# Altium schematic sheet schematic.SchDoc: MMA Controller Shield
size A4; DrawnBy: Sandro Petrovski; SheetNumber: 1; SheetTotal: 1; SheetSize: A4
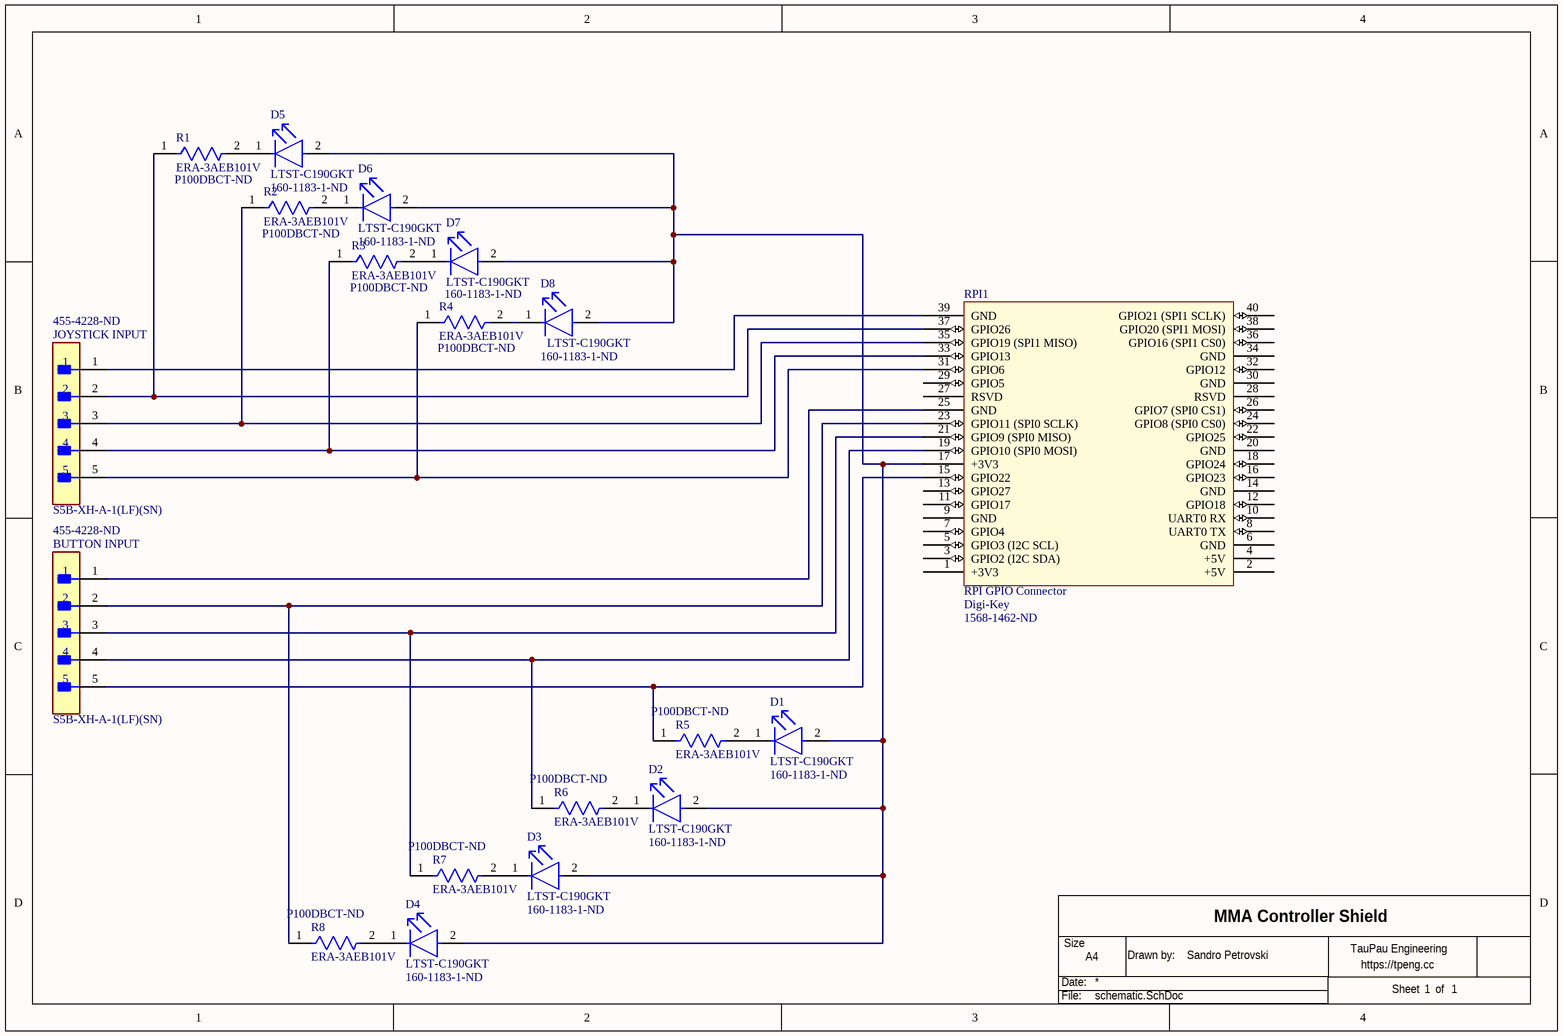
[diagram p0: schematic.SchDoc]

## Parts
*  TPE Title Block  (value not drawn)
BUTTON_INPUT  S5B-XH-A-1(LF)(SN)  Supplier Part Number 1: 455-4228-ND  [FP-S5B-XH-A-1_LF_SN-MFG]
D1  LTST-C190GKT  Supplier Part Number 1: 160-1183-1-ND  [FP-LTST-C190GKT-MFG]
D2  LTST-C190GKT  Supplier Part Number 1: 160-1183-1-ND  [FP-LTST-C190GKT-MFG]
D3  LTST-C190GKT  Supplier Part Number 1: 160-1183-1-ND  [FP-LTST-C190GKT-MFG]
D4  LTST-C190GKT  Supplier Part Number 1: 160-1183-1-ND  [FP-LTST-C190GKT-MFG]
D5  LTST-C190GKT  Supplier Part Number 1: 160-1183-1-ND  [FP-LTST-C190GKT-MFG]
D6  LTST-C190GKT  Supplier Part Number 1: 160-1183-1-ND  [FP-LTST-C190GKT-MFG]
D7  LTST-C190GKT  Supplier Part Number 1: 160-1183-1-ND  [FP-LTST-C190GKT-MFG]
D8  LTST-C190GKT  Supplier Part Number 1: 160-1183-1-ND  [FP-LTST-C190GKT-MFG]
JOYSTICK_INPUT  S5B-XH-A-1(LF)(SN)  Supplier Part Number 1: 455-4228-ND  [FP-S5B-XH-A-1_LF_SN-MFG]
R1  ERA-3AEB101V  Supplier Part Number 1: P100DBCT-ND  [FP-ERA3A-IPC_B]
R2  ERA-3AEB101V  Supplier Part Number 1: P100DBCT-ND  [FP-ERA3A-IPC_B]
R3  ERA-3AEB101V  Supplier Part Number 1: P100DBCT-ND  [FP-ERA3A-IPC_B]
R4  ERA-3AEB101V  Supplier Part Number 1: P100DBCT-ND  [FP-ERA3A-IPC_B]
R5  ERA-3AEB101V  Supplier Part Number 1: P100DBCT-ND  [FP-ERA3A-IPC_B]
R6  ERA-3AEB101V  Supplier Part Number 1: P100DBCT-ND  [FP-ERA3A-IPC_B]
R7  ERA-3AEB101V  Supplier Part Number 1: P100DBCT-ND  [FP-ERA3A-IPC_B]
R8  ERA-3AEB101V  Supplier Part Number 1: P100DBCT-ND  [FP-ERA3A-IPC_B]
RPI1  RPI GPIO Connector  Supplier 1: Digi-Key  Supplier Part Number 1: 1568-1462-ND  [rpi]

## Nets
NetBUTTON_INPUT_1: BUTTON_INPUT.1 RPI1.25(GND)
NetBUTTON_INPUT_2: BUTTON_INPUT.2 R8.1 RPI1.23(GPIO11_(SPI0_SCLK))
NetBUTTON_INPUT_3: BUTTON_INPUT.3 R7.1 RPI1.21(GPIO9_(SPI0_MISO))
NetBUTTON_INPUT_4: BUTTON_INPUT.4 R6.1 RPI1.19(GPIO10_(SPI0_MOSI))
NetBUTTON_INPUT_5: BUTTON_INPUT.5 R5.1 RPI1.15(GPIO22)
NetD1_1: D1.1(C) R5.2
NetD1_2: D1.2(A) D2.2(A) D3.2(A) D4.2(A) D5.2(A) D6.2(A) D7.2(A) D8.2(A) RPI1.17(+3V3)
NetD2_1: D2.1(C) R6.2
NetD3_1: D3.1(C) R7.2
NetD4_1: D4.1(C) R8.2
NetD5_1: D5.1(C) R1.2
NetD6_1: D6.1(C) R2.2
NetD7_1: D7.1(C) R3.2
NetD8_1: D8.1(C) R4.2
NetJOYSTICK_INPUT_1: JOYSTICK_INPUT.1 RPI1.39(GND)
NetJOYSTICK_INPUT_2: JOYSTICK_INPUT.2 R1.1 RPI1.37(GPIO26)
NetJOYSTICK_INPUT_3: JOYSTICK_INPUT.3 R2.1 RPI1.35(GPIO19_(SPI1_MISO))
NetJOYSTICK_INPUT_4: JOYSTICK_INPUT.4 R3.1 RPI1.33(GPIO13)
NetJOYSTICK_INPUT_5: JOYSTICK_INPUT.5 R4.1 RPI1.31(GPIO6)

Not connected (* = marked no-connect by the designer): RPI1 1(+3V3) 2(+5V) 3(GPIO2_(I2C_SDA)) 4(+5V) 5(GPIO3_(I2C_SCL)) 6(GND) 7(GPIO4) 8(UART0_TX) 9(GND) 10(UART0_RX) 11(GPIO17) 12(GPIO18) 13(GPIO27) 14(GND) 16(GPIO23) 18(GPIO24) 20(GND) 22(GPIO25) 24(GPIO8_(SPI0_CS0)) 26(GPIO7_(SPI0_CS1)) 27(RSVD) 28(RSVD) 29(GPIO5) 30(GND) 32(GPIO12) 34(GND) 36(GPIO16_(SPI1_CS0)) 38(GPIO20_(SPI1_MOSI)) 40(GPIO21_(SPI1_SCLK))

## Notes on the sheet
- (in symbol TPE Title Block) Size; TauPau Engineering; Drawn by:; https://tpeng.cc; Date:; Sheet; of; File:

## Library data of the parts
BUTTON_INPUT JOYSTICK_INPUT = CMP-17439-000362-1: CONN HEADER R/A 5POS 2.5MM; Manufacturer: JST; Number of Positions: 5; Voltage Rating: 250V; Contact Shape: Square; Number of Rows: 1; Lead Free: Lead Free; Contact Material: Brass; Termination: Press-Fit; Connector Type: Header; Contact Finish - Mating: TIN; Insulation Color: Natural; Packaging: Bulk; Min Operating Temperature: -25°C; Series: XH; Mount: Through Hole; Contact Type: Male Pin; Insulation Material: Nylon; Max Operating Temperature: 85°C; Pitch: 2.5mm; Fastening Type: Detent; Flammability Rating: UL94 V-0; Supplier 1: Digi-Key; Manufacturer Part Number: S5B-XH-A-1(LF)(SN); RoHS: Yes; Category: Headers and Wire Housings; Stock 1: 1175; Pricing 1: 1=0.34, 10=0.289, 100=0.2245, 500=0.1924, 1000=0.16033, 5000=0.13742, 10000=0.12826 (USD); ComponentLink1URL: https://datasheet.ciiva.com/16484/s5b-xh-a-1lfsn-16484586.pdf?src-supplier=Future+Electronics; ComponentLink1Description: https://datasheet.ciiva.com/16484/s5b-xh-a-1lfsn-16484586.pdf?src-supplier=Future+Electronics
D1-D8 = CMP-22017-000005-2: LED GREEN CLEAR CHIP SMD; Manufacturer: Vishay Lite-On; Dominant Wavelength: 569nm; Reverse Voltage: 5V; Lens Color: Colorless; Viewing Angle: 130°; Voltage: 2V; Forward Current: 30mA; Power Dissipation: 100mW; Luminous Intensity: 6mcd; Number of LEDs: 1; Forward Voltage: 2.1V; Wavelength: 565nm; Test Current: 10mA; Shape: Rectangular; Optoelectronic Device Type: SINGLE COLOR LED; Overall Height: 0.8mm; Min Operating Temperature: -55°C; Lens Style: Clear; Mount: Surface Mount; Width: 0.8mm; Packaging: Tape and Reel; Lens Transparency: Clear; Case Code (Metric): 1608; Depth: 0.8mm; Case Code (Imperial): 0603; Case/Package: 0603; Number of Pins: 2; Max Operating Temperature: 85°C; Lead Free: Lead Free; Number of Elements: 1; Length: 1.6mm; Height: 0.8mm; Package Quantity: 1; Power Rating: 100mW; Radiation Hardening: No; Illumination Color: Green; Color: Green; Supplier 1: Digi-Key; Manufacturer Part Number: LTST-C190GKT; RoHS: Yes; Category: LEDs; Stock 1: 271465; Pricing 1: 1=0.24, 10=0.132, 100=0.0611, 500=0.0564, 1000=0.04418, 2000=0.04324 (USD); Mounting Technology: Surface Mount; Pins: 2; Color@wavelength: Green; Terminal Finish: Tin; Channels: 1; Luminous Intensity-Nom: 6mcd; Reverse Voltage-Max: 5V; JESD-609 Code: e3; Size: 1.1mm; Terminal Pitch: 1.5mm; RoHS Compliant: Yes; Reach SVHC Compliant: Yes; ComponentLink1URL: https://datasheet.ciiva.com:443/pdfs/VipMasterIC/IC/LITE/LITES10869/LITES10869-1.pdf?src-supplier=IHS+Markit; ComponentLink1Description: https://datasheet.ciiva.com:443/pdfs/VipMasterIC/IC/LITE/LITES10869/LITES10869-1.pdf?src-supplier=IHS+Markit; ComponentLink2URL: https://datasheet.ciiva.com/2109/ltst-c190gkt-2109985.pdf?src-supplier=Digi-Key; ComponentLink2Description: https://datasheet.ciiva.com/2109/ltst-c190gkt-2109985.pdf?src-supplier=Digi-Key; ComponentLink3URL: https://datasheet.ciiva.com/12403/lite-on-ltst-c190gkt-187204-12403884.pdf?src-supplier=Mouser; ComponentLink3Description: https://datasheet.ciiva.com/12403/lite-on-ltst-c190gkt-187204-12403884.pdf?src-supplier=Mouser; ComponentLink4URL: https://datasheet.ciiva.com/16392/lite-on20ltst-c190gkt-16392818.pdf?src-supplier=Future+Electronics; ComponentLink4Description: https://datasheet.ciiva.com/16392/lite-on20ltst-c190gkt-16392818.pdf?src-supplier=Future+Electronics; ComponentLink5URL: https://datasheet.ciiva.com/11775/0900766b80dc02a6-11775616.pdf?src-supplier=Rs; ComponentLink5Description: https://datasheet.ciiva.com/11775/0900766b80dc02a6-11775616.pdf?src-supplier=Rs; ComponentLink6URL: https://datasheet.ciiva.com/2109/ltst-c190gkt-2109986.pdf?src-supplier=Digi-Key; ComponentLink6Description: https://datasheet.ciiva.com/2109/ltst-c190gkt-2109986.pdf?src-supplier=Digi-Key; ComponentLink7URL: https://datasheet.ciiva.com/2109/ltst-c190gkt-2109987.pdf?src-supplier=Digi-Key; ComponentLink7Description: https://datasheet.ciiva.com/2109/ltst-c190gkt-2109987.pdf?src-supplier=Digi-Key
R1-R8 = CMP-2000-00870-2: RES SMD 100 OHM 0.1% 1/10W 0603; Manufacturer: Panasonic; Voltage Rating: 75V; Power Rating: 100mW; Resistance: 100R; Temperature Coefficient: 25ppm/°C; Value: 100R; Rated Temperature: 85°C; Package Height: 0.45mm; Package Length: 1.6mm; Package Width: 0.8mm; Reference Standard: AEC-Q200; Number of Terminations: 2; Case/Package: 0603; Termination: SMD/SMT; Number of Pins: 2; Size Code: 0603; Length: 1.6mm; Min Operating Temperature: -55°C; Resistor Type: Thin Film; Depth: 0.8mm; Military Standard: Not; Packaging: Tape and Reel; RoHS Compliant: Yes; Construction: Rectangular; Resistance Tolerance: 0.1%; Contact Plating: Tin; Width: 0.8mm; Mount: Surface Mount; Case Code (Metric): 1608; Max Operating Temperature: 155°C; Height: 0.45mm; Case Code (Imperial): 0603; Series: ERA-3A; Package Quantity: 5000; REACH SVHC: No SVHC; Tolerance: 0.1%; Max Power Dissipation: 100mW; Radiation Hardening: No; Technology: METAL FILM; Supplier 1: Digi-Key; Manufacturer Part Number: ERA-3AEB101V; RoHS: Yes; Category: Chip SMD Resistors; Stock 1: 122159; Pricing 1: 1=0.31, 10=0.262, 50=0.1382, 100=0.1025, 500=0.06198, 1000=0.0429 (USD); Mounting Technology: Surface Mount; Pins: 2; Terminal Finish: Nickel; Power: 100mW; Working Voltage: 75V; Package Style: SMTMeter; JESD-609 Code: e3; Reach SVHC Compliant: Yes; ComponentLink1URL: https://datasheet.ciiva.com:443/pdfs/VipMasterIC/IC/PANA/PANA-S-A0009459258/PANA-S-A0009459258-1.pdf?src-supplier=IHS+Markit; ComponentLink1Description: https://datasheet.ciiva.com:443/pdfs/VipMasterIC/IC/PANA/PANA-S-A0009459258/PANA-S-A0009459258-1.pdf?src-supplier=IHS+Markit; ComponentLink2URL: https://datasheet.ciiva.com/11808/0900766b80fe20f7-11808029.pdf?src-supplier=Rs; ComponentLink2Description: https://datasheet.ciiva.com/11808/0900766b80fe20f7-11808029.pdf?src-supplier=Rs; ComponentLink3URL: https://datasheet.ciiva.com/29183/450355-da-01-en-widerstand-0603-era-29183658.pdf?src-supplier=Conrad; ComponentLink3Description: https://datasheet.ciiva.com/29183/450355-da-01-en-widerstand-0603-era-29183658.pdf?src-supplier=Conrad; ComponentLink4URL: https://datasheet.ciiva.com/46422/485442-46422518.pdf?src-supplier=Element14; ComponentLink4Description: https://datasheet.ciiva.com/46422/485442-46422518.pdf?src-supplier=Element14; ComponentLink5URL: https://datasheet.ciiva.com/5734/485442-5734520.pdf?src-supplier=Farnell; ComponentLink5Description: https://datasheet.ciiva.com/5734/485442-5734520.pdf?src-supplier=Farnell; ComponentLink6URL: https://datasheet.ciiva.com/46422/485442-46422517.pdf?src-supplier=Element14; ComponentLink6Description: https://datasheet.ciiva.com/46422/485442-46422517.pdf?src-supplier=Element14; ComponentLink7URL: https://datasheet.ciiva.com/48425/era-eng-tds-48425407.pdf?src-supplier=Distrelec; ComponentLink7Description: https://datasheet.ciiva.com/48425/era-eng-tds-48425407.pdf?src-supplier=Distrelec; ComponentLink8URL: https://datasheet.ciiva.com/7830/485442-7830582.pdf?src-supplier=Element14; ComponentLink8Description: https://datasheet.ciiva.com/7830/485442-7830582.pdf?src-supplier=Element14; ComponentLink9URL: https://datasheet.ciiva.com/5734/485442-5734521.pdf?src-supplier=Farnell; ComponentLink9Description: https://datasheet.ciiva.com/5734/485442-5734521.pdf?src-supplier=Farnell; ComponentLink10URL: https://datasheet.ciiva.com/28513/39837-28513817.pdf?src-supplier=Element14; ComponentLink10Description: https://datasheet.ciiva.com/28513/39837-28513817.pdf?src-supplier=Element14; ComponentLink11URL: https://datasheet.ciiva.com/16725/70068849-16725037.pdf?src-supplier=Allied+Electronics; ComponentLink11Description: https://datasheet.ciiva.com/16725/70068849-16725037.pdf?src-supplier=Allied+Electronics; ComponentLink12URL: https://datasheet.ciiva.com/9186/aoa0000ce26-9186735.pdf?src-supplier=Avnet; ComponentLink12Description: https://datasheet.ciiva.com/9186/aoa0000ce26-9186735.pdf?src-supplier=Avnet; ComponentLink13URL: https://datasheet.ciiva.com/45928/54aoa0000ce26-45928637.pdf?src-supplier=Onlinecomponents.com; ComponentLink13Description: https://datasheet.ciiva.com/45928/54aoa0000ce26-45928637.pdf?src-supplier=Onlinecomponents.com
RPI1 = rpi connector: GPIO Header for Raspberry Pi A+/B+/Pi 2/Pi 3 - 2x20; Manufacturer: SparkFun Electronics; Manufacturer Part Number: PRT-14017; Nils Minor: author; nilsminor@web.de: mail; RoHS: RoHS Compliant; Category: Development Boards, Kits, Programmers; Stock 1: 150; Pricing 1: 1=1.84 (EUR); Part Status: Active; Accessory Type: Connector; For Use With/Related Products: Raspberry Pi; ComponentLink1URL: https://cdn.sparkfun.com/datasheets/Dev/RaspberryPi/12313.pdf; ComponentLink1Description: https://cdn.sparkfun.com/datasheets/Dev/RaspberryPi/12313.pdf